# EAGLE design Interface Board (EAGLE 9.6.2)
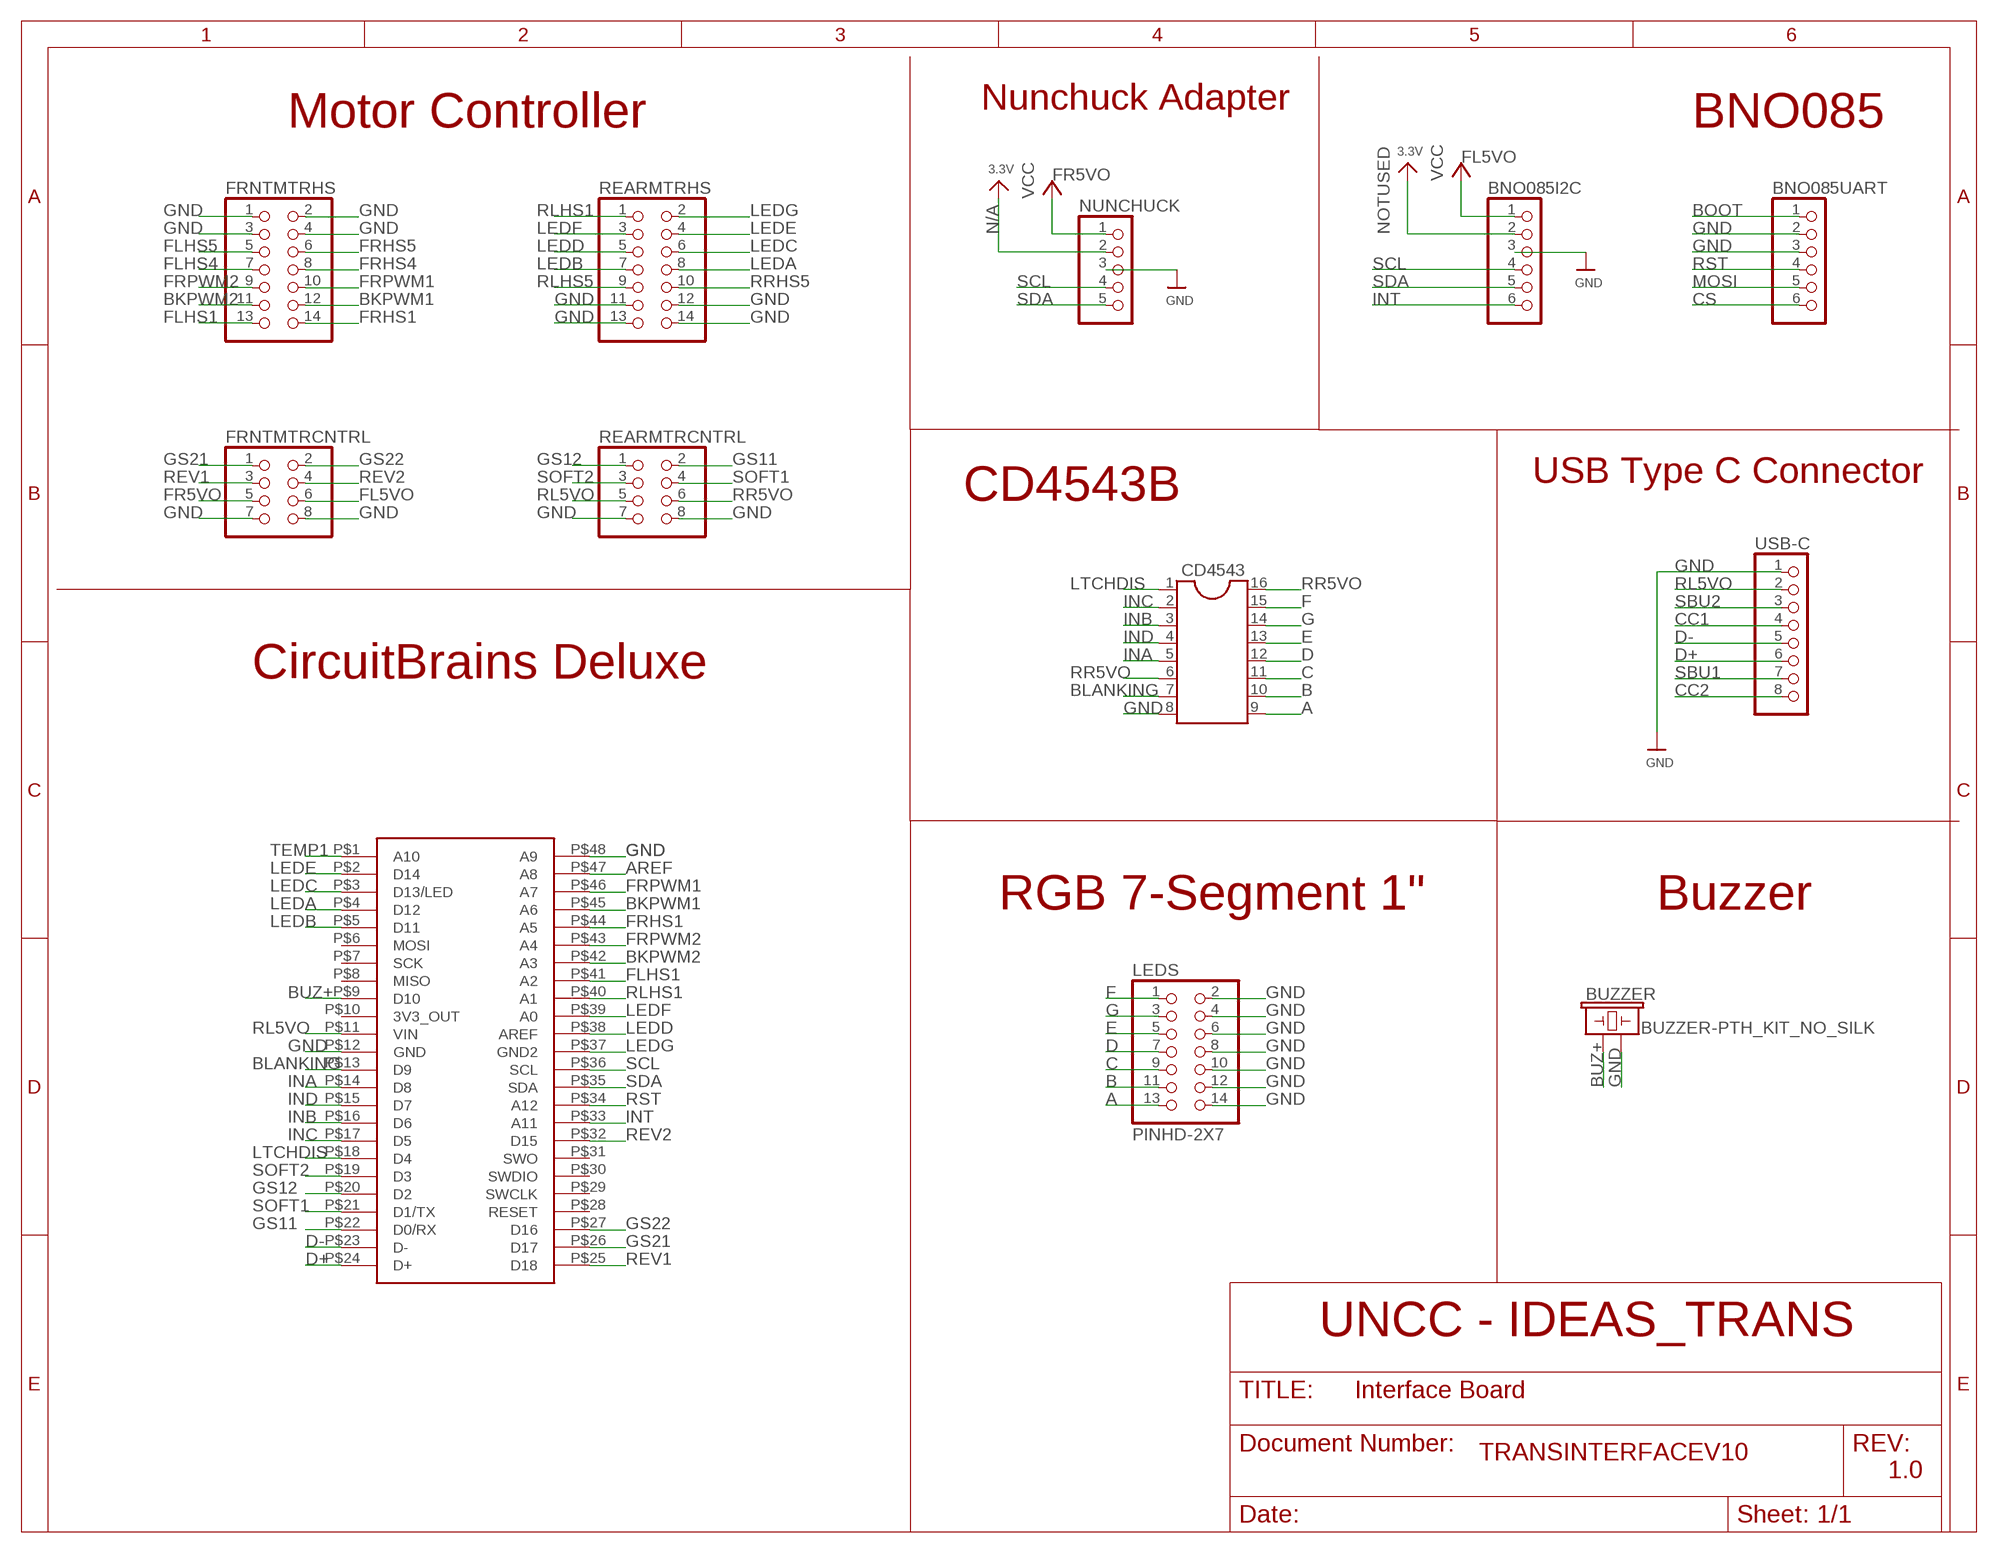
[diagram p0: schematic, sheet 1]

## Parts
BNO085I2C  HEADER-1X670MIL  [1X06_ROUND_70]
BNO085UART  HEADER-1X670MIL  [1X06_ROUND_70]
BUZZER  BUZZER-PTH_KIT_NO_SILK  [BUZZER-12MM-NS-KIT]
CD4543  DIL16  [DIL16]
FRNTMTRCNTRL  PINHD-2X4  [2X04]
FRNTMTRHS  PINHD-2X7  [2X07]
LEDS  PINHD-2X7  [2X07]
NUNCHUCK  HEADER-1X570MIL  [1X05_ROUND_70]
REARMTRCNTRL  PINHD-2X4  [2X04]
REARMTRHS  PINHD-2X7  [2X07]
U$1  CIRCUITBRAINS_DELUXEHANDSOLDER  [DELUXE_48SOM_29MMX29MM_HANDSOLDER]
USB-C  HEADER-1X876MIL  [1X08_ROUND_76]

## Nets
A: CD4543.9 LEDS.13
AREF: U$1.P$47(A8)
B: CD4543.10 LEDS.11
BKPWM1: FRNTMTRHS.12 U$1.P$45(A6)
BKPWM2: FRNTMTRHS.11 U$1.P$42(A3)
BLANKING: CD4543.7 U$1.P$13(D9)
BOOT: BNO085UART.1
BUZ+: BUZZER.+ U$1.P$9(D10)
C: CD4543.11 LEDS.9
CC1: USB-C.4
CC2: USB-C.8
CS: BNO085UART.6
D: CD4543.12 LEDS.7
D+: U$1.P$24(D+) USB-C.6
D-: U$1.P$23(D-) USB-C.5
E: CD4543.13 LEDS.5
F: CD4543.15 LEDS.1
FL5VO: BNO085I2C.1 FRNTMTRCNTRL.6 ; supply symbol labelled VCC
FLHS1: FRNTMTRHS.13 U$1.P$41(A2)
FLHS4: FRNTMTRHS.7
FLHS5: FRNTMTRHS.5
FR5VO: FRNTMTRCNTRL.5 NUNCHUCK.1 ; supply symbol labelled VCC
FRHS1: FRNTMTRHS.14 U$1.P$44(A5)
FRHS4: FRNTMTRHS.8
FRHS5: FRNTMTRHS.6
FRPWM1: FRNTMTRHS.10 U$1.P$46(A7)
FRPWM2: FRNTMTRHS.9 U$1.P$43(A4)
G: CD4543.14 LEDS.3
GND: BNO085I2C.3 BNO085UART.2 BNO085UART.3 BUZZER.- CD4543.8 FRNTMTRCNTRL.7 FRNTMTRCNTRL.8 FRNTMTRHS.1 FRNTMTRHS.2 FRNTMTRHS.3 FRNTMTRHS.4 LEDS.2 LEDS.4 LEDS.6 LEDS.8 LEDS.10 LEDS.12 LEDS.14 NUNCHUCK.3 REARMTRCNTRL.7 REARMTRCNTRL.8 REARMTRHS.11 REARMTRHS.12 REARMTRHS.13 REARMTRHS.14 U$1.P$12(GND) U$1.P$48(A9) USB-C.1
GS11: REARMTRCNTRL.2 U$1.P$22(D0/RX)
GS12: REARMTRCNTRL.1 U$1.P$20(D2)
GS21: FRNTMTRCNTRL.1 U$1.P$26(D17)
GS22: FRNTMTRCNTRL.2 U$1.P$27(D16)
INA: CD4543.5 U$1.P$14(D8)
INB: CD4543.3 U$1.P$16(D6)
INC: CD4543.2 U$1.P$17(D5)
IND: CD4543.4 U$1.P$15(D7)
INT: BNO085I2C.6 U$1.P$33(A11)
LEDA: REARMTRHS.8 U$1.P$4(D12)
LEDB: REARMTRHS.7 U$1.P$5(D11)
LEDC: REARMTRHS.6 U$1.P$3(D13/LED)
LEDD: REARMTRHS.5 U$1.P$38(AREF)
LEDE: REARMTRHS.4 U$1.P$2(D14)
LEDF: REARMTRHS.3 U$1.P$39(A0)
LEDG: REARMTRHS.2 U$1.P$37(GND2)
LTCHDIS: CD4543.1 U$1.P$18(D4)
MOSI: BNO085UART.5
N/A [lowpower]: NUNCHUCK.2 ; supply symbol labelled 3.3V
NOTUSED [lowpower]: BNO085I2C.2 ; supply symbol labelled 3.3V
REV1: FRNTMTRCNTRL.3 U$1.P$25(D18)
REV2: FRNTMTRCNTRL.4 U$1.P$32(D15)
RL5VO: REARMTRCNTRL.5 U$1.P$11(VIN) USB-C.2
RLHS1: REARMTRHS.1 U$1.P$40(A1)
RLHS5: REARMTRHS.9
RR5VO: CD4543.6 CD4543.16 REARMTRCNTRL.6
RRHS5: REARMTRHS.10
RST: BNO085UART.4 U$1.P$34(A12)
SBU1: USB-C.7
SBU2: USB-C.3
SCL: BNO085I2C.4 NUNCHUCK.4 U$1.P$36(SCL)
SDA: BNO085I2C.5 NUNCHUCK.5 U$1.P$35(SDA)
SOFT1: REARMTRCNTRL.4 U$1.P$21(D1/TX)
SOFT2: REARMTRCNTRL.3 U$1.P$19(D3)
TEMP1: U$1.P$1(A10)
Unconnected: U$1.P$6(MOSI) U$1.P$7(SCK) U$1.P$8(MISO) U$1.P$28(RESET) U$1.P$29(SWCLK) U$1.P$30(SWDIO) U$1.P$31(SWO)

## Notes on the sheet
- Nunchuck Adapter
- Motor Controller | BNO085
- USB Type C Connector
- CD4543B
- CircuitBrains Deluxe
- RGB 7-Segment 1" | Buzzer
- UNCC - IDEAS_TRANS
- TRANSINTERFACEV10
- 1.0

## Power pins joined to a net without a drawn wire
3V3_OUT: U$1.P$10(3V3_OUT)

## Library data of the parts
BNO085I2C BNO085UART = microbuilder:HEADER-1X6: PIN HEADER
BUZZER = SparkFun-Electromechanical:BUZZER: Buzzer Small round buzzers that operate around the audible 2kHz range. You can use these as speakers to create simple music or user interfaces. Variant Overview: PTH - Mini Speaker - PC Mount 12mm 2.048kHz <https://www.sparkfun.com/products/7950> PTH_KIT - Mini Speaker - PC Mount 12mm 2.048kHz <https://www.sparkfun.com/products/7950> KIT simplifies soldering by adding stop mask to one side of the pads. PTH_NO_SILK - Mini Speaker - PC Mount 12mm 2.048kHz <https://www.sparkfun.com/products/7950> No silkscreen indicator of buzzer outline. PTH_KIT_NO_SILK - Mini Speaker - PC Mount 12mm 2.048kHz <https://www.sparkfun.com/products/7950> KIT package w/o silkscreen SMD - Buzzer Audio Magnetic (CCV-084B16) SMD buzzer used on, e.g. the LilyPad Buzzer <https://www.sparkfun.com/products/8463> and RFID USB Reader <https://www.sparkfun.com/products/9963>. SMD_KIT - Buzzer Audio Magnetic (CCV-084B16) SMD Buzzer with elongated pins to make soldering easier. Used on the SparkFun Simon Says - Surface Mount Soldering Kit <https://www.sparkfun.com/products/10935>.; PROD_ID: COMP-08253; SF_SKU: COM-07950
CD4543 = ic-package:DIL16: Dual In Line / Socket
FRNTMTRCNTRL REARMTRCNTRL = pinhead:PINHD-2X4: PIN HEADER
FRNTMTRHS REARMTRHS = pinhead:PINHD-2X7: PIN HEADER
LEDS = Connector:PINHD-2X7: PIN HEADER; CATEGORY: CONNECTOR; SUB-CATEGORY: PIN-HEADER
NUNCHUCK = microbuilder:HEADER-1X5: PIN HEADER
U$1 = CircuitBrainsModule:CIRCUITBRAINS_DELUXE
USB-C = microbuilder:HEADER-1X8: PIN HEADER

## Net classes
1 highpower: width 0.305 mm, drill 0.483 mm
2 lowpower: width 0.254 mm, drill 0.483 mm

## Board
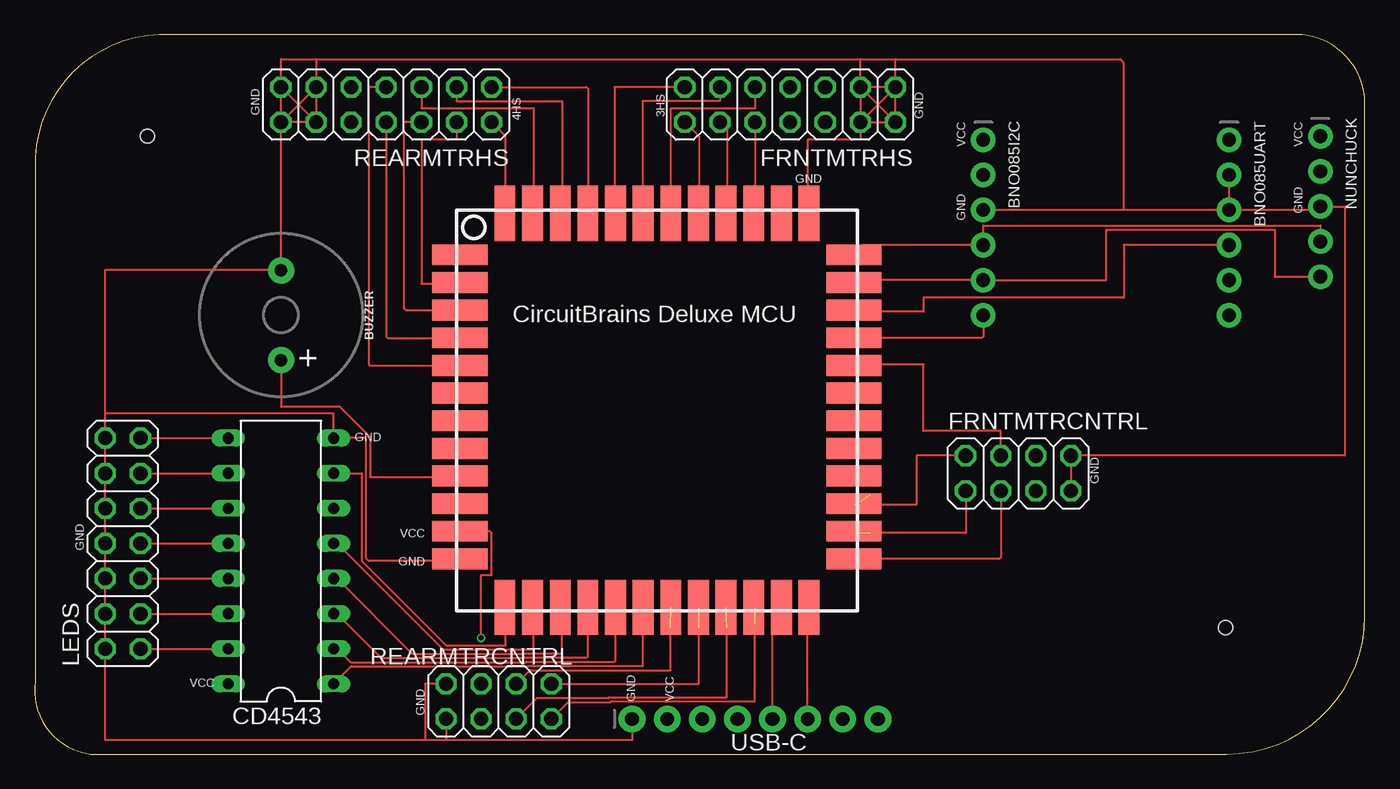
[diagram p1: board, top side]
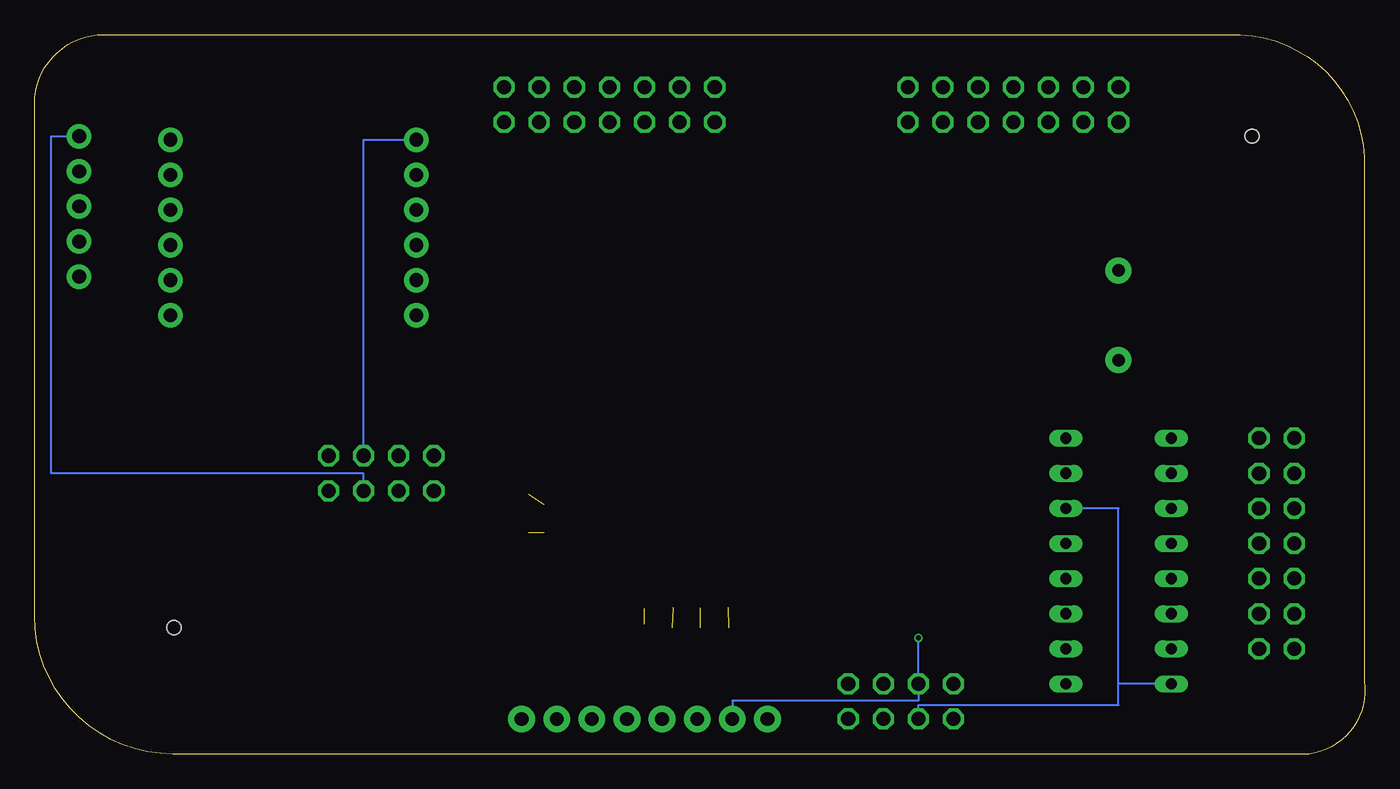
[diagram p2: board, bottom side, seen from below]

Size 96.23 x 52.06 mm. Coordinates in mm from the lower left corner, seen from the top.
Outline: 0.04,42.31 0.04,5.25 arc90 4.02,0 86.23,0 arc90 96.23,10 96.23,47.06 arc90 91.23,52.06 9.02,52.06 arc90 0.04,42.31
Copper layers (1*16): Top 0.035559375mm / dielectric 1.6mm / Bottom 0.035559375mm
Design rules "oshpark-2layer": minimum track width 6mil, minimum drill 10mil, track to track 6mil, track to pad 6mil, pad to pad 6mil, via to via 6mil, smd to smd 6mil, copper to edge 15mil, drill to drill 6mil, minimum pad ring 5mil, minimum via ring 5mil, stop-mask expansion 2.5mil, vias tented up to drill 0mil, thermal gap 10mil
Holes 1 mm at 8.17,44.7 86.14,9.14

### Footprints (pad centres in the part's own frame; a part is rotated, then mirrored left to right if it is on the bottom)
1X06_ROUND_70 = drill 1 pad 1.778: 1 -6.35,0; 2 -3.81,0; 3 -1.27,0; 4 1.27,0; 5 3.81,0; 6 6.35,0
BUZZER-12MM-NS-KIT = drill 0.9 pad 1.88: + 3.25,0; - -3.25,0
DIL16 = drill 0.813 long: 1 -8.89,-3.81; 2 -6.35,-3.81; 3 -3.81,-3.81; 4 -1.27,-3.81; 5 1.27,-3.81; 6 3.81,-3.81; 7 6.35,-3.81; 8 8.89,-3.81; 9 8.89,3.81; 10 6.35,3.81; 11 3.81,3.81; 12 1.27,3.81; 13 -1.27,3.81; 14 -3.81,3.81; 15 -6.35,3.81; 16 -8.89,3.81
2X04 = drill 1.016 octagon: 1 -3.81,-1.27; 2 -3.81,1.27; 3 -1.27,-1.27; 4 -1.27,1.27; 5 1.27,-1.27; 6 1.27,1.27; 7 3.81,-1.27; 8 3.81,1.27
2X07 = drill 1.016 octagon: 1 -7.62,-1.27; 2 -7.62,1.27; 3 -5.08,-1.27; 4 -5.08,1.27; 5 -2.54,-1.27; 6 -2.54,1.27; 7 0,-1.27; 8 0,1.27; 9 2.54,-1.27; 10 2.54,1.27; 11 5.08,-1.27; 12 5.08,1.27; 13 7.62,-1.27; 14 7.62,1.27
1X05_ROUND_70 = drill 1 pad 1.778: 1 -5.08,0; 2 -2.54,0; 3 0,0; 4 2.54,0; 5 5.08,0
DELUXE_48SOM_29MMX29MM_HANDSOLDER = smd 4 x 1.5: P$1 0.25,-3.25; P$2 0.25,-5.25; P$3 0.25,-7.25; P$4 0.25,-9.25; P$5 0.25,-11.25; P$6 0.25,-13.25; P$7 0.25,-15.25; P$8 0.25,-17.25; P$9 0.25,-19.25; P$10 0.25,-21.25; P$11 0.25,-23.25; P$12 0.25,-25.25; P$25 28.75,-25.25; P$26 28.75,-23.25; P$27 28.75,-21.25; P$28 28.75,-19.25; P$29 28.75,-17.25; P$30 28.75,-15.25; P$31 28.75,-13.25; P$32 28.75,-11.25; P$33 28.75,-9.25; P$34 28.75,-7.25; P$35 28.75,-5.25; P$36 28.75,-3.25 | smd 1.5 x 4: P$13 3.5,-28.75; P$14 5.5,-28.75; P$15 7.5,-28.75; P$16 9.5,-28.75; P$17 11.5,-28.75; P$18 13.5,-28.75; P$19 15.5,-28.75; P$20 17.5,-28.75; P$21 19.5,-28.75; P$22 21.5,-28.75; P$23 23.5,-28.75; P$24 25.5,-28.75; P$37 3.5,-0.25; P$38 5.5,-0.25; P$39 7.5,-0.25; P$40 9.5,-0.25; P$41 11.5,-0.25; P$42 13.5,-0.25; P$43 15.5,-0.25; P$44 17.5,-0.25; P$45 19.5,-0.25; P$46 21.5,-0.25; P$47 23.5,-0.25; P$48 25.5,-0.25
1X08_ROUND_76 = drill 1 pad 1.93: 1 -8.89,0; 2 -6.35,0; 3 -3.81,0; 4 -1.27,0; 5 1.27,0; 6 3.81,0; 7 6.35,0; 8 8.89,0

### Placement (x,y rotation side)
BNO085I2C  68.62,38.1 270 top
BNO085UART  86.4,38.1 270 top
BUZZER  17.82,31.75 270 top
CD4543  17.82,13.97 90 top
FRNTMTRCNTRL  71.16,20.32 0 top
FRNTMTRHS  54.65,46.99 180 top
LEDS  6.39,15.24 90 top
NUNCHUCK  93,39.62 270 top
REARMTRCNTRL  33.57,3.81 180 top
REARMTRHS  25.44,46.99 180 top
U$1  30.52,39.37 0 top
USB-C  52.11,2.54 0 top

### Tracks (layer width: path | path; a pad name or v marks a point on that pad's centre or on a via)
A
  Top 0.152: LEDS.13 CD4543.9
B
  Top 0.152: LEDS.11 CD4543.10
BKPWM1
  Top 0.152: FRNTMTRHS.12 50.08,45.21 50.08,39.18 U$1.P$45
BKPWM2
  Top 0.152: FRNTMTRHS.11 49.57,47.24 43.98,47.24 43.98,39.16 U$1.P$42
BLANKING
  Top 0.152: CD4543.7 23.66,20.32 23.66,13.97 29.76,7.87 34.07,7.87 34.07,10.56 U$1.P$13
BUZ+
  Top 0.152: BUZZER.+ 17.82,25.15 22.06,25.15 24.27,22.93 24.27,20.07 30.71,20.07 U$1.P$9
C
  Top 0.152: LEDS.9 CD4543.11
D
  Top 0.152: LEDS.7 CD4543.12
D+
  Top 0.152: USB-C.6 55.92,10.52 U$1.P$24
D-
  Top 0.152: USB-C.5 53.38,9.98 U$1.P$23
E
  Top 0.152: LEDS.5 CD4543.13
F
  Top 0.152: LEDS.1 CD4543.15
FL5VO
  Bottom 0.152: FRNTMTRCNTRL.6 72.43,44.45 BNO085I2C.1
FLHS1
  Top 0.152: FRNTMTRHS.13 41.95,48.26 41.95,39.19 U$1.P$41
FR5VO
  Bottom 0.152: FRNTMTRCNTRL.5 72.43,20.32 95.03,20.32 95.03,44.7 NUNCHUCK.1
FRHS1
  Top 0.152: FRNTMTRHS.14 48.04,44.7 48.04,39.15 U$1.P$44
FRPWM1
  Top 0.152: FRNTMTRHS.10 52.11,39.21 U$1.P$46
FRPWM2
  Top 0.152: U$1.P$43 46.01,46.71 52.11,46.71 FRNTMTRHS.9
G
  Top 0.152: LEDS.3 CD4543.14
GND
  Top 0.152: USB-C.1 43.22,1.02 29.76,1.02 | REARMTRCNTRL.8 29.76,1.02 | 29.76,1.02 28.23,1.02 | 28.23,1.02 5.12,1.02 LEDS.2 LEDS.4 LEDS.6 LEDS.8 LEDS.10 LEDS.12 LEDS.14 5.12,24.64 | 5.12,24.64 5.12,35.05 17.77,35.05 BUZZER.- REARMTRHS.14 | 5.12,24.64 21.63,24.64 CD4543.8 23.91,22.86 23.97,22.81 23.97,14.17 24.17,13.97 27.98,13.97 30.62,13.97 U$1.P$12 | REARMTRCNTRL.7 28.23,5.08 28.23,1.02 | REARMTRHS.14 REARMTRHS.13 | REARMTRHS.11 REARMTRHS.12 | REARMTRHS.12 REARMTRHS.14 | REARMTRHS.14 REARMTRHS.11 | REARMTRHS.13 REARMTRHS.12 | REARMTRHS.13 17.82,50.29 20.36,50.29 | 20.36,50.29 REARMTRHS.11 | 20.36,50.29 59.73,50.29 | 59.73,50.29 62.27,50.29 | 62.27,50.29 78.52,50.29 78.78,50.04 78.78,39.37 | BNO085UART.3 92.75,39.37 NUNCHUCK.3 94.78,39.62 94.78,21.59 FRNTMTRCNTRL.8 FRNTMTRCNTRL.7 | BNO085UART.3 78.78,39.37 | 78.78,39.37 BNO085I2C.3 | BNO085UART.2 BNO085UART.3 | FRNTMTRHS.4 59.73,44.45 55.92,44.45 55.92,39.22 U$1.P$48 | FRNTMTRHS.4 FRNTMTRHS.2 | FRNTMTRHS.2 FRNTMTRHS.1 | FRNTMTRHS.1 FRNTMTRHS.3 | FRNTMTRHS.3 FRNTMTRHS.4 | FRNTMTRHS.4 FRNTMTRHS.1 | FRNTMTRHS.3 FRNTMTRHS.2 | FRNTMTRHS.3 59.73,50.29 | FRNTMTRHS.1 62.27,50.29
GS11  (1 unrouted)
  Top 0.152: 52.11,10.53 U$1.P$22 | REARMTRCNTRL.2 38.6,3.76 41.64,3.76 41.69,3.81 52.11,3.81 52.11,9.4
GS12  (1 unrouted)
  Top 0.152: 48.04,10.59 U$1.P$20 | REARMTRCNTRL.1 48.04,5.08 48.04,9.14
GS21  (1 unrouted)
  Top 0.152: 59.39,16 U$1.P$26 | FRNTMTRCNTRL.1 67.35,16 60.49,16
GS22  (1 unrouted)
  Top 0.152: 59.35,18.03 U$1.P$27 | 60.49,18.8 60.49,18.03 63.79,18.03 63.79,21.59 FRNTMTRCNTRL.2
INA
  Top 0.152: CD4543.5 21.88,15.24 29.55,7.57 35.17,7.57 35.2,7.59 36.08,7.59 36.11,7.62 36.11,10.53 U$1.P$14
INB
  Top 0.152: CD4543.3 21.88,10.16 25.08,6.96 35.42,6.96 35.45,6.98 39.92,6.98 40.02,7.09 U$1.P$16
INC
  Top 0.152: CD4543.2 21.88,7.62 22.85,6.65 35.55,6.65 35.57,6.68 41.95,6.68 42.02,6.75 U$1.P$17
IND
  Top 0.152: CD4543.4 21.88,12.7 27.32,7.26 35.3,7.26 35.32,7.29 38.14,7.29 38.14,10.5 U$1.P$15
INT
  Top 0.152: BNO085I2C.6 68.62,30.23 68.51,30.12 U$1.P$33
LEDA
  Top 0.152: REARMTRHS.8 25.44,30.23 25.54,30.12 U$1.P$4
LEDB
  Top 0.152: REARMTRHS.7 24.17,48.26 24.17,28.19 24.24,28.12 U$1.P$5
LEDC
  Top 0.152: REARMTRHS.6 26.71,45.72 26.71,32.26 26.85,32.12 U$1.P$3
LEDD
  Top 0.152: REARMTRHS.5 27.98,46.74 36.11,46.74 36.11,39.21 U$1.P$38
LEDE
  Top 0.152: REARMTRHS.4 30.52,44.45 27.98,44.45 27.98,34.04 30.68,34.04 U$1.P$2
LEDF
  Top 0.152: REARMTRHS.3 30.52,47.24 38.14,47.24 38.14,39.24 U$1.P$39
LEDG
  Top 0.152: REARMTRHS.2 34.02,44.76 U$1.P$37
LTCHDIS
  Top 0.152: CD4543.1 22.9,6.35 35.68,6.35 35.7,6.37 43.98,6.37 44.02,6.41 U$1.P$18
REV1
  Top 0.152: FRNTMTRCNTRL.3 69.89,14.22 69.78,14.12 U$1.P$25
REV2
  Top 0.152: FRNTMTRCNTRL.4 69.89,23.37 64.3,23.37 64.3,28.19 59.34,28.19 U$1.P$32
RL5VO  (via drill 0.35)
  Top 0.152: v32.3,8.4 32.3,12.95 33.06,12.95 33.06,16 32.94,16.12 U$1.P$11
  Bottom 0.152: v32.3,8.4 REARMTRCNTRL.5 32.3,3.86 45.76,3.86 USB-C.2
RLHS1
  Top 0.152: REARMTRHS.1 39.92,48.26 40.02,48.16 U$1.P$40
RR5VO
  Bottom 0.152: REARMTRCNTRL.6 32.3,3.56 17.82,3.56 17.82,5.08 | 17.82,5.08 17.82,17.78 CD4543.6 | CD4543.16 17.82,5.08
RST
  Top 0.152: BNO085UART.4 78.78,36.83 78.78,33.02 64.3,33.02 64.3,32 59.38,32 U$1.P$34
SCL
  Top 0.152: U$1.P$36 59.98,36.83 BNO085I2C.4 68.62,38.25 93,38.25 NUNCHUCK.4
SDA
  Top 0.152: U$1.P$35 59.44,34.29 BNO085I2C.5 77.51,34.29 77.51,37.95 89.7,37.95 89.7,34.54 NUNCHUCK.5
SOFT1  (1 unrouted)
  Top 0.152: REARMTRCNTRL.4 36.36,4.06 41.52,4.06 41.57,4.11 50.08,4.11 50.08,9.14
SOFT2  (1 unrouted)
  Top 0.152: REARMTRCNTRL.3 35.83,6.07 43.22,6.07 45.99,6.07 46.01,6.1 46.01,9.14

### Text on the board
tPlace: 3HS | 4HS | GND | GND | VCC | VCC | GND | GND | GND | CircuitBrains Deluxe MCU | + | GND | GND | VCC | GND | GND | VCC | GND | VCC | GND | USB-C